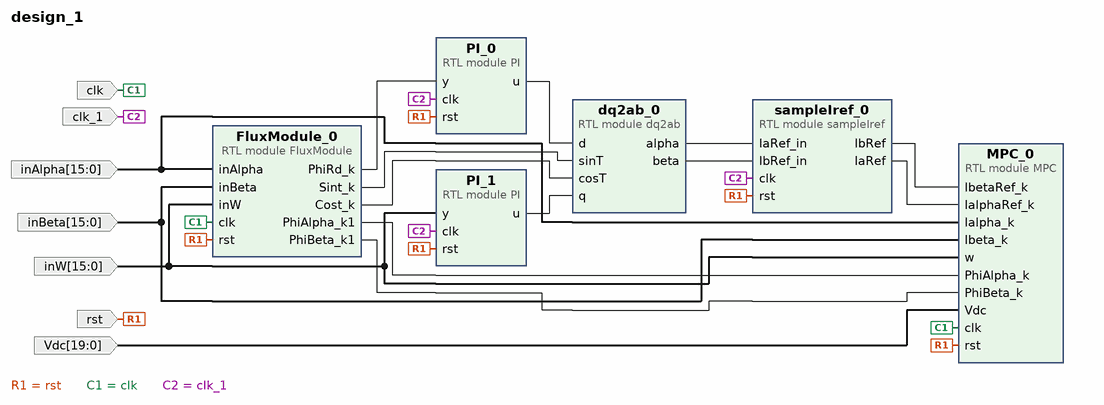
[diagram p0: block diagram of the top level]
# Vivado block design design_1, xc7z020clg400-1, Vivado 2016.4
create_bd_design design_1

create_bd_port -dir I -type rst rst
create_bd_port -dir I -type clk clk
create_bd_port -dir I -from 15 -to 0 inAlpha
create_bd_port -dir I -from 15 -to 0 inBeta
create_bd_port -dir I -from 15 -to 0 inW
create_bd_port -dir I -from 19 -to 0 Vdc
create_bd_port -dir I -type clk clk_1

create_bd_cell -type module -reference FluxModule FluxModule_0
set_property -dict {CONFIG.dWidth 20} [get_bd_cells FluxModule_0]
create_bd_cell -type module -reference MPC MPC_0
create_bd_cell -type module -reference sampleIref sampleIref_0
create_bd_cell -type module -reference dq2ab dq2ab_0
set_property -dict {CONFIG.dWidth 20} [get_bd_cells dq2ab_0]
create_bd_cell -type module -reference PI PI_0
set_property -dict {CONFIG.dWidth 20} [get_bd_cells PI_0]
create_bd_cell -type module -reference PI PI_1
set_property -dict {CONFIG.dWidth 20} [get_bd_cells PI_1]

# ---- connections ----

connect_bd_net [get_bd_ports rst] \
  [get_bd_pins FluxModule_0/rst] [get_bd_pins MPC_0/rst] [get_bd_pins sampleIref_0/rst] [get_bd_pins PI_0/rst] \
  [get_bd_pins PI_1/rst]
connect_bd_net [get_bd_ports clk] [get_bd_pins FluxModule_0/clk] [get_bd_pins MPC_0/clk]
connect_bd_net [get_bd_ports inAlpha] [get_bd_pins FluxModule_0/inAlpha] [get_bd_pins MPC_0/Ialpha_k]
connect_bd_net [get_bd_ports inBeta] [get_bd_pins FluxModule_0/inBeta] [get_bd_pins MPC_0/Ibeta_k]
connect_bd_net [get_bd_ports inW] [get_bd_pins FluxModule_0/inW] [get_bd_pins MPC_0/w] [get_bd_pins PI_1/y]
connect_bd_net [get_bd_pins FluxModule_0/PhiAlpha_k1] [get_bd_pins MPC_0/PhiAlpha_k]
connect_bd_net [get_bd_pins FluxModule_0/PhiBeta_k1] [get_bd_pins MPC_0/PhiBeta_k]
connect_bd_net [get_bd_ports Vdc] [get_bd_pins MPC_0/Vdc]
connect_bd_net [get_bd_pins PI_0/u] [get_bd_pins dq2ab_0/d]
connect_bd_net [get_bd_pins PI_1/u] [get_bd_pins dq2ab_0/q]
connect_bd_net [get_bd_pins FluxModule_0/Sint_k] [get_bd_pins dq2ab_0/sinT]
connect_bd_net [get_bd_pins FluxModule_0/Cost_k] [get_bd_pins dq2ab_0/cosT]
connect_bd_net [get_bd_pins FluxModule_0/PhiRd_k] [get_bd_pins PI_0/y]
connect_bd_net -net clk_1_1 [get_bd_ports clk_1] [get_bd_pins sampleIref_0/clk] [get_bd_pins PI_0/clk] [get_bd_pins PI_1/clk]
connect_bd_net [get_bd_pins dq2ab_0/alpha] [get_bd_pins sampleIref_0/IaRef_in]
connect_bd_net [get_bd_pins dq2ab_0/beta] [get_bd_pins sampleIref_0/IbRef_in]
connect_bd_net [get_bd_pins sampleIref_0/IbRef] [get_bd_pins MPC_0/IbetaRef_k]
connect_bd_net [get_bd_pins sampleIref_0/IaRef] [get_bd_pins MPC_0/IalphaRef_k]

validate_bd_design
save_bd_design
